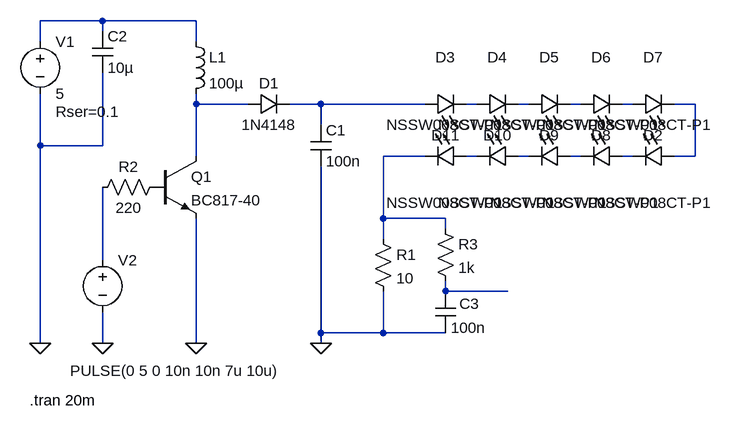
[diagram p0: schematic LedDrv.asc]
LedDrv.asc, the LTspice schematic file:
Version 4
SHEET 1 1112 680
WIRE 160 -64 64 -64
WIRE 304 -64 160 -64
WIRE 160 -48 160 -64
WIRE 64 -32 64 -64
WIRE 304 -32 304 -64
WIRE 304 64 304 48
WIRE 384 64 304 64
WIRE 496 64 448 64
WIRE 656 64 496 64
WIRE 736 64 720 64
WIRE 816 64 800 64
WIRE 896 64 880 64
WIRE 976 64 960 64
WIRE 1072 64 1040 64
WIRE 496 96 496 64
WIRE 64 128 64 48
WIRE 160 128 160 16
WIRE 160 128 64 128
WIRE 304 144 304 64
WIRE 656 144 592 144
WIRE 736 144 720 144
WIRE 816 144 800 144
WIRE 896 144 880 144
WIRE 976 144 960 144
WIRE 1072 144 1072 64
WIRE 1072 144 1040 144
WIRE 592 240 592 144
WIRE 688 240 592 240
WIRE 688 256 688 240
WIRE 592 272 592 240
WIRE 160 304 160 192
WIRE 688 352 688 336
WIRE 784 352 688 352
WIRE 496 416 496 160
WIRE 592 416 592 352
WIRE 592 416 496 416
WIRE 688 416 592 416
WIRE 64 432 64 128
WIRE 160 432 160 384
WIRE 304 432 304 240
WIRE 496 432 496 416
FLAG 496 432 0
FLAG 304 432 0
FLAG 64 432 0
FLAG 160 432 0
SYMBOL npn 240 144 R0
SYMATTR InstName Q1
SYMATTR Value BC817-40
SYMBOL ind 288 -48 R0
SYMATTR InstName L1
SYMATTR Value 100µ
SYMBOL diode 384 80 R270
WINDOW 0 32 32 VTop 2
WINDOW 3 0 32 VBottom 2
SYMATTR InstName D1
SYMATTR Value 1N4148
SYMBOL cap 480 96 R0
SYMATTR InstName C1
SYMATTR Value 100n
SYMBOL voltage 64 -48 R0
WINDOW 123 0 0 Left 2
WINDOW 39 24 124 Left 2
SYMATTR SpiceLine Rser=0.1
SYMATTR InstName V1
SYMATTR Value 5
SYMBOL voltage 160 288 R0
WINDOW 123 0 0 Left 2
WINDOW 39 0 0 Left 2
WINDOW 3 -50 186 Left 2
SYMATTR InstName V2
SYMATTR Value PULSE(0 5 0 10n 10n 7u 10u)
SYMBOL cap 144 -48 R0
SYMATTR InstName C2
SYMATTR Value 10µ
SYMBOL res 256 176 R90
WINDOW 0 0 56 VBottom 2
WINDOW 3 32 56 VTop 2
SYMATTR InstName R2
SYMATTR Value 220
SYMBOL res 576 256 R0
SYMATTR InstName R1
SYMATTR Value 10
SYMBOL LED 656 80 R270
WINDOW 0 72 32 VTop 2
WINDOW 3 0 32 VBottom 2
SYMATTR InstName D3
SYMATTR Value NSSW008CT-P1
SYMATTR Description Diode
SYMATTR Type diode
SYMBOL LED 736 80 R270
WINDOW 0 72 32 VTop 2
WINDOW 3 0 32 VBottom 2
SYMATTR InstName D4
SYMATTR Value NSSW008CT-P1
SYMATTR Description Diode
SYMATTR Type diode
SYMBOL LED 816 80 R270
WINDOW 0 72 32 VTop 2
WINDOW 3 0 32 VBottom 2
SYMATTR InstName D5
SYMATTR Value NSSW008CT-P1
SYMATTR Description Diode
SYMATTR Type diode
SYMBOL LED 896 80 R270
WINDOW 0 72 32 VTop 2
WINDOW 3 0 32 VBottom 2
SYMATTR InstName D6
SYMATTR Value NSSW008CT-P1
SYMATTR Description Diode
SYMATTR Type diode
SYMBOL LED 976 80 R270
WINDOW 0 72 32 VTop 2
WINDOW 3 0 32 VBottom 2
SYMATTR InstName D7
SYMATTR Value NSSW008CT-P1
SYMATTR Description Diode
SYMATTR Type diode
SYMBOL LED 1040 128 R90
WINDOW 0 0 32 VBottom 2
WINDOW 3 72 32 VTop 2
SYMATTR InstName D2
SYMATTR Value NSSW008CT-P1
SYMATTR Description Diode
SYMATTR Type diode
SYMBOL LED 960 128 R90
WINDOW 0 0 32 VBottom 2
WINDOW 3 72 32 VTop 2
SYMATTR InstName D8
SYMATTR Value NSSW008CT-P1
SYMATTR Description Diode
SYMATTR Type diode
SYMBOL LED 880 128 R90
WINDOW 0 0 32 VBottom 2
WINDOW 3 72 32 VTop 2
SYMATTR InstName D9
SYMATTR Value NSSW008CT-P1
SYMATTR Description Diode
SYMATTR Type diode
SYMBOL LED 800 128 R90
WINDOW 0 0 32 VBottom 2
WINDOW 3 72 32 VTop 2
SYMATTR InstName D10
SYMATTR Value NSSW008CT-P1
SYMATTR Description Diode
SYMATTR Type diode
SYMBOL LED 720 128 R90
WINDOW 0 0 32 VBottom 2
WINDOW 3 72 32 VTop 2
SYMATTR InstName D11
SYMATTR Value NSSW008CT-P1
SYMATTR Description Diode
SYMATTR Type diode
SYMBOL res 672 240 R0
SYMATTR InstName R3
SYMATTR Value 1k
SYMBOL cap 672 352 R0
WINDOW 0 37 19 Left 2
SYMATTR InstName C3
SYMATTR Value 100n
TEXT 48 520 Left 2 !.tran 20m

The netlist it stands for:
* LedDrv.asc
Q1 N002 P001 0 0 BC817-40
L1 N001 N002 100µ
D1 N002 N003 1N4148
C1 N003 0 100n
V1 N001 0 5 Rser=0.1
V2 N014 0 PULSE(0 5 0 10n 10n 7u 10u)
C2 N001 0 10µ
R2 P001 N014 220
R1 N009 0 10
D3 N003 N004 NSSW008CT-P1
D4 N004 N005 NSSW008CT-P1
D5 N005 N006 NSSW008CT-P1
D6 N006 N007 NSSW008CT-P1
D7 N007 N008 NSSW008CT-P1
D2 N008 N013 NSSW008CT-P1
D8 N013 N012 NSSW008CT-P1
D9 N012 N011 NSSW008CT-P1
D10 N011 N010 NSSW008CT-P1
D11 N010 N009 NSSW008CT-P1
R3 N009 N015 1k
C3 N015 0 100n
.model D D
.lib standard.dio
.model NPN NPN
.model PNP PNP
.lib standard.bjt
.tran 20m
.backanno
.end